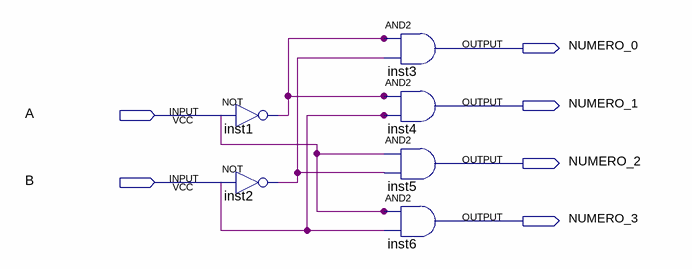
[diagram p0: schematic sheet]
// Quartus schematic Decodificador.bdf as structural Verilog: 6 symbols, 6 pins
module Decodificador (
  input  A,
  input  B,
  output NUMERO_0,
  output NUMERO_1,
  output NUMERO_2,
  output NUMERO_3
);

  wire inst1_out, inst2_out;

  not inst1 (inst1_out, A);
  not inst2 (inst2_out, B);
  and inst3 (NUMERO_0, inst1_out, inst2_out);
  and inst4 (NUMERO_1, inst1_out, B);
  and inst5 (NUMERO_2, A, inst2_out);
  and inst6 (NUMERO_3, A, B);
endmodule
